# EAGLE design BEP3_Test_Interface (EAGLE 6.5.0)
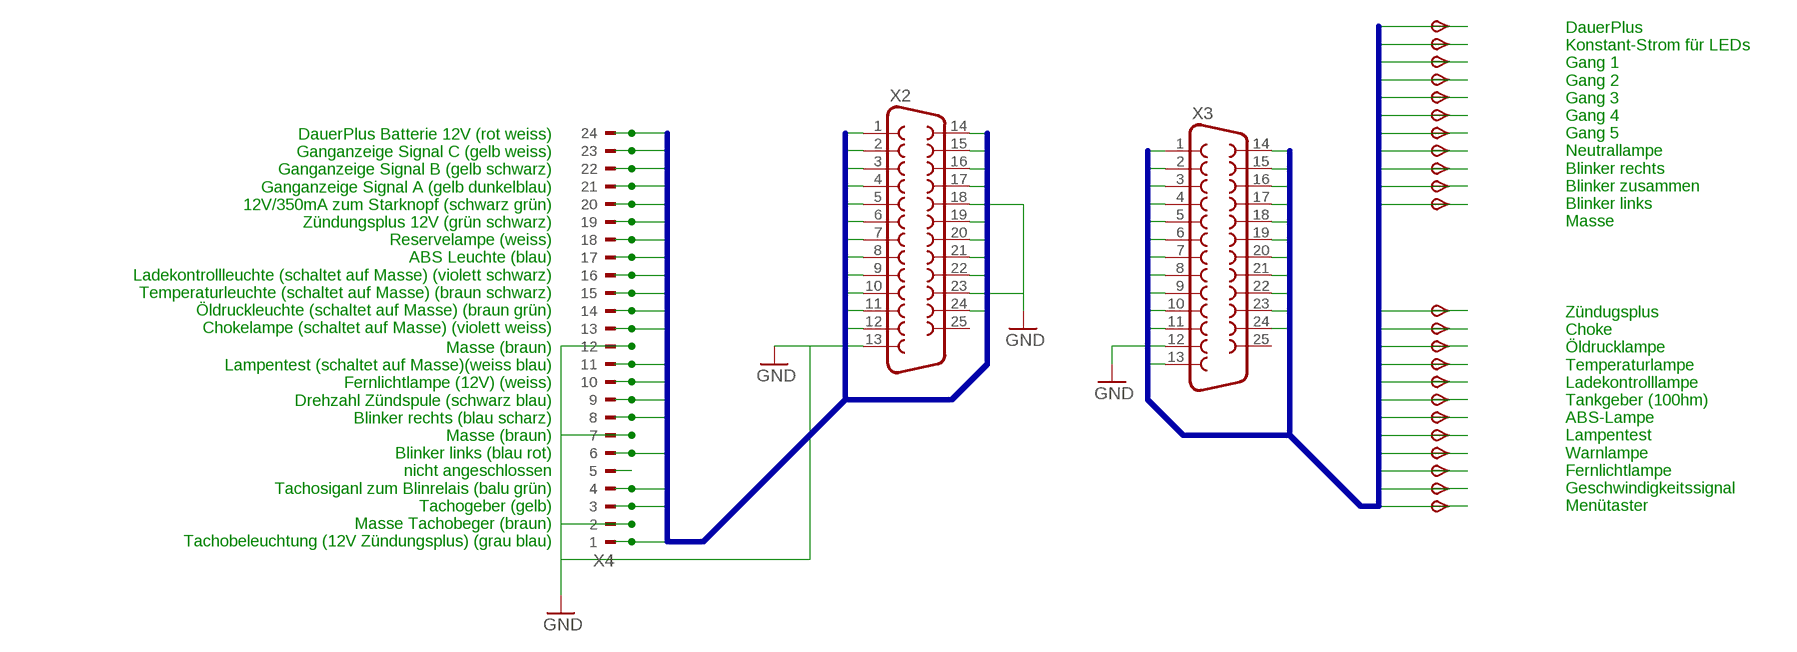
[diagram p0: schematic, sheet 1]

## Parts
TP1  TPSFEDERPIN  [1,36ID]
TP2  TPSFEDERPIN  [1,36ID]
TP3  TPSFEDERPIN  [1,36ID]
TP4  TPSFEDERPIN  [1,36ID]
TP5  TPSFEDERPIN  [1,36ID]
TP6  TPSFEDERPIN  [1,36ID]
TP7  TPSFEDERPIN  [1,36ID]
TP8  TPSFEDERPIN  [1,36ID]
TP9  TPSFEDERPIN  [1,36ID]
TP10  TPSFEDERPIN  [1,36ID]
TP11  TPSFEDERPIN  [1,36ID]
TP12  TPSFEDERPIN  [1,36ID]
TP13  TPSFEDERPIN  [1,36ID]
TP16  TPSFEDERPIN  [1,36ID]
TP17  TPSFEDERPIN  [1,36ID]
TP18  TPSFEDERPIN  [1,36ID]
TP19  TPSFEDERPIN  [1,36ID]
TP21  TPSFEDERPIN  [1,36ID]
TP22  TPSFEDERPIN  [1,36ID]
TP23  TPSFEDERPIN  [1,36ID]
TP24  TPSFEDERPIN  [1,36ID]
TP25  TPSFEDERPIN  [1,36ID]
TP26  TPSFEDERPIN  [1,36ID]
X2  F25H  [F25H]
X3  F25H  [F25H]
X4  CON_BMWTESTPINS  [24-TESTPIN_1,36ID]

## Nets
BMW1: X2.1 X4.P24
BMW2: X2.2 X4.P23
BMW3: X2.3 X4.P22
BMW4: X2.4 X4.P21
BMW5: X2.5 X4.P20
BMW6: X2.6 X4.P19
BMW7: X2.7 X4.P18
BMW8: X2.8 X4.P17
BMW9: X2.9 X4.P16
BMW10: X2.10 X4.P15
BMW11: X2.11 X4.P14
BMW12: X2.12 X4.P13
BMW14: X2.14 X4.P11
BMW15: X2.15 X4.P10
BMW16: X2.16 X4.P9
BMW17: X2.17 X4.P8
BMW19: X2.19 X4.P6
BMW20: X2.20
BMW21: X2.21 X4.P4
BMW22: X2.22 X4.P3
BMW24: X2.24 X4.P1
GND: X2.13 X2.18 X2.23 X3.12 X4.P2 X4.P7 X4.P12
N$1: X4.P5
WAGO1: TP1.P$1(PP) X3.1
WAGO2: TP2.P$1(PP) X3.2
WAGO3: TP3.P$1(PP) X3.3
WAGO4: TP4.P$1(PP) X3.4
WAGO5: TP5.P$1(PP) X3.5
WAGO6: TP6.P$1(PP) X3.6
WAGO7: TP7.P$1(PP) X3.7
WAGO8: TP8.P$1(PP) X3.8
WAGO9: TP9.P$1(PP) X3.9
WAGO10: TP10.P$1(PP) X3.10
WAGO11: TP11.P$1(PP) X3.11
WAGO13: TP12.P$1(PP) X3.13
WAGO14: TP16.P$1(PP) X3.14
WAGO15: TP17.P$1(PP) X3.15
WAGO16: TP18.P$1(PP) X3.16
WAGO17: TP19.P$1(PP) X3.17
WAGO18: TP21.P$1(PP) X3.18
WAGO19: TP22.P$1(PP) X3.19
WAGO20: TP23.P$1(PP) X3.20
WAGO21: TP24.P$1(PP) X3.21
WAGO22: TP25.P$1(PP) X3.22
WAGO23: TP26.P$1(PP) X3.23
WAGO24: TP13.P$1(PP) X3.24
Unconnected: X2.25 X3.25

## Buses
BMW[1..24]
WAGO[1..24]

## Notes on the sheet
- DauerPlus
  Konstant-Strom für LEDs
  Gang 1
  Gang 2
  Gang 3
  Gang 4
  Gang 5
  Neutrallampe
  Blinker rechts
  Blinker zusammen
  Blinker links
  Masse
- DauerPlus Batterie 12V (rot weiss)
  Ganganzeige Signal C (gelb weiss)
  Ganganzeige Signal B (gelb schwarz)
  Ganganzeige Signal A (gelb dunkelblau)
  12V/350mA zum Starknopf (schwarz grün)
  Zündungsplus 12V (grün schwarz)
  Reservelampe (weiss)
  ABS Leuchte (blau)
  Ladekontrollleuchte (schaltet auf Masse) (violett schwarz)
  Temperaturleuchte (schaltet auf Masse) (braun schwarz)
  Öldruckleuchte (schaltet auf Masse) (braun grün)
  Chokelampe (schaltet auf Masse) (violett weiss)
- Zündugsplus
  Choke
  Öldrucklampe
  Temperaturlampe
  Ladekontrolllampe
  Tankgeber (100hm)
  ABS-Lampe
  Lampentest
  Warnlampe
  Fernlichtlampe
  Geschwindigkeitssignal
  Menütaster
- Masse (braun)
  Lampentest (schaltet auf Masse)(weiss blau)
  Fernlichtlampe (12V) (weiss)
  Drehzahl Zündspule (schwarz blau)
  Blinker rechts (blau scharz)
  Masse (braun)
  Blinker links (blau rot)
  nicht angeschlossen
  Tachosiganl zum Blinrelais (balu grün)
  Tachogeber (gelb)
  Masse Tachobeger (braun)
  Tachobeleuchtung (12V Zündungsplus) (grau blau)

## Library data of the parts
TP1-TP13 TP16-TP19 TP21-TP26 = testpin_BMW:TPS: TEST PIN
X2 X3 = con-subd:F25: SUB-D; OC_FARNELL: unknown; OC_NEWARK: unknown
X4 = con_BMW:CON_BMW: BMW CONNECTOR

## Board
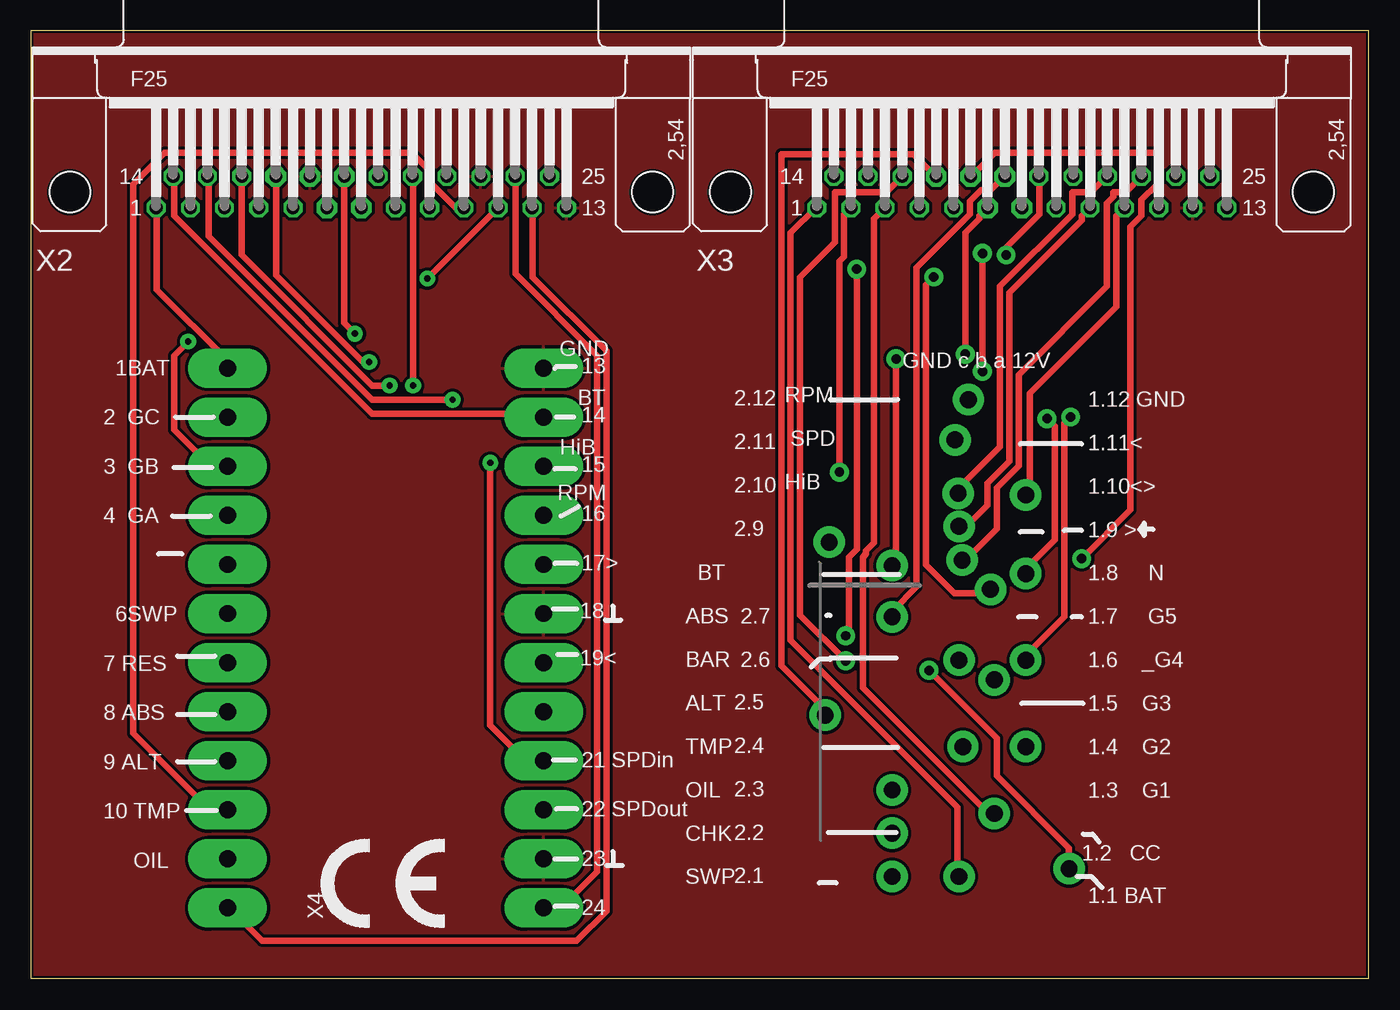
[diagram p1: board, top side]
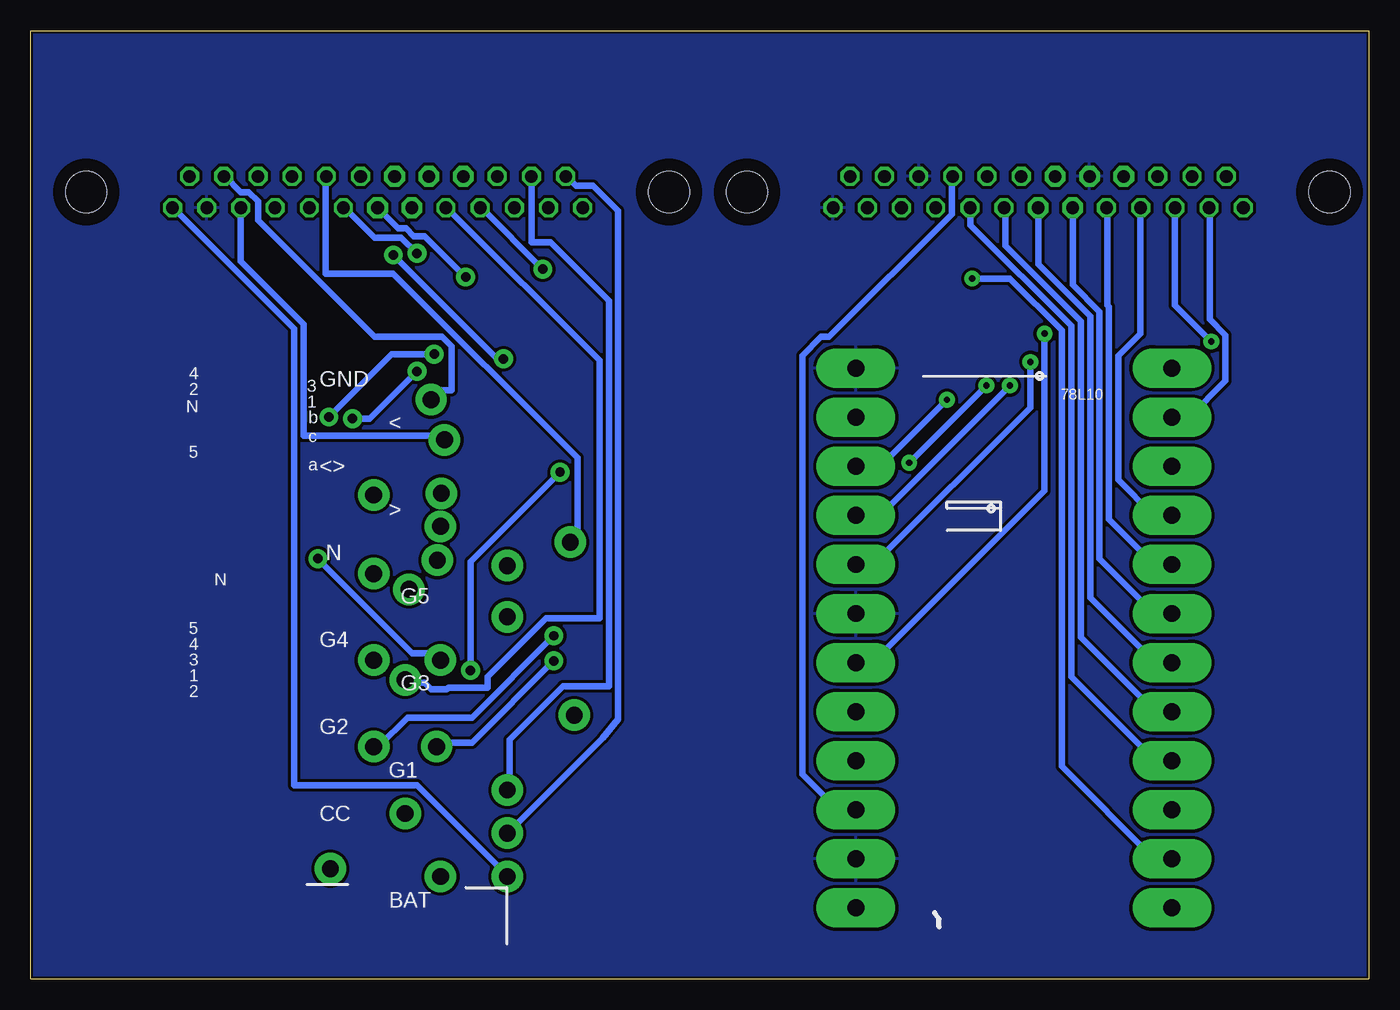
[diagram p2: board, bottom side, seen from below]

Size 108 x 76.5 mm. Coordinates in mm from the lower left corner, seen from the top.
Outline: 108,76.5 0,76.5 0,0 108,0 108,76.5
Copper layers (1*16): Top 0.035mm / dielectric 1.5mm / Bottom 0.035mm
Design rules "default *": minimum track width 20mil, minimum drill 20mil, track to track 10mil, track to pad 10mil, pad to pad 10mil, via to via 10mil, smd to smd 8mil, copper to edge 8mil, drill to drill 8mil, minimum pad ring 10mil, minimum via ring 15mil, stop-mask expansion 4mil, vias tented up to drill 0mil, thermal gap 10mil

### Footprints (pad centres in the part's own frame; a part is rotated, then mirrored left to right if it is on the bottom)
1,36ID = drill 1.36 pad 2.54: P$1 0,0
F25H = drill 1.016 octagon: 1 -16.561,-1.27; 2 -13.792,-1.27; 3 -11.049,-1.27; 4 -8.28,-1.27; 5 -5.512,-1.27; 8 2.769,-1.27; 9 5.512,-1.27; 10 8.28,-1.27; 11 11.049,-1.27; 12 13.792,-1.27; 13 16.561,-1.27; 14 -15.189,1.27; 15 -12.421,1.27; 16 -9.652,1.27; 20 1.372,1.27; 21 4.14,1.27; 22 6.909,1.27; 23 9.652,1.27; 24 12.421,1.27; 25 15.189,1.27 | drill 1.016 pad 1.67 octagon: 6 -2.769,-1.27; 7 0,-1.27; 17 -6.909,1.27; 18 -4.14,1.27; 19 -1.372,1.27 | hole 3.302: -23.52,0; 23.52,0
24-TESTPIN_1,36ID = drill 1.36 pad 3.2 long: P1 -21.78,-12.76; P2 -17.82,-12.76; P3 -13.86,-12.76; P4 -9.9,-12.76; P5 -5.94,-12.76; P6 -1.98,-12.76; P7 1.98,-12.76; P8 5.94,-12.76; P9 9.9,-12.76; P10 13.86,-12.76; P11 17.82,-12.76; P12 21.78,-12.76; P13 -21.78,12.76; P14 -17.82,12.76; P15 -13.86,12.76; P16 -9.9,12.76; P17 -5.94,12.76; P18 -1.98,12.76; P19 1.98,12.76; P20 5.94,12.76; P21 9.9,12.76; P22 13.86,12.76; P23 17.82,12.76; P24 21.78,12.76

### Placement (x,y rotation side)
TP1  74.93,8.26 0 bottom
TP2  83.82,8.89 0 bottom
TP3  77.79,13.34 0 bottom
TP4  80.33,18.73 0 bottom
TP5  77.79,24.13 0 bottom
TP6  80.33,25.72 0 bottom
TP7  77.47,31.43 0 bottom
TP8  80.33,32.7 0 bottom
TP9  74.93,36.51 0 bottom
TP10  80.33,39.05 0 bottom
TP11  74.61,43.5 0 bottom
TP12  69.53,8.26 0 bottom
TP13  75.69,46.74 0 bottom
TP16  69.53,11.75 0 bottom
TP17  69.53,15.24 0 bottom
TP18  75.25,18.73 0 bottom
TP19  64.14,21.27 0 bottom
TP21  74.93,25.72 0 bottom
TP22  69.53,29.21 0 bottom
TP23  69.53,33.34 0 bottom
TP24  64.45,35.24 0 bottom
TP25  74.87,39.18 0 bottom
TP26  75.18,33.78 0 bottom
U$1  [CE_10.00]  23.37,4.06 0 top
X2  26.67,63.5 0 top
X3  80.01,63.5 0 top
X4  28.64,27.5 90 top

### Tracks (layer width: path | path; a pad name or v marks a point on that pad's centre or on a via)
BMW1
  Top 0.508: X4.P24 15.88,49.91 10.16,55.63 10.16,62.23 X2.1
BMW2
  Bottom 0.508: X2.2 12.83,62.23 12.83,53.21 11.56,51.94 11.56,48.26 14.48,45.34 15.88,45.34 X4.P23
BMW3  (via drill 0.51)
  Top 0.508: v12.7,51.44 11.56,50.29 11.56,44.32 14.48,41.4 15.88,41.4 X4.P22
  Bottom 0.508: X2.3 15.62,54.36 v12.7,51.44
BMW4
  Bottom 0.508: X2.4 18.41,62.23 18.41,52.07 20.19,50.29 20.19,40.26 17.4,37.47 15.88,37.47 X4.P21
BMW5
  Bottom 0.508: X2.5 21.08,62.23 21.08,54.36 20.95,54.23 20.95,37.08 17.4,33.53 15.88,33.53 X4.P20
BMW6
  Bottom 0.508: X2.6 23.88,62.23 23.88,56.01 21.72,53.85 21.72,33.91 17.4,29.59 15.88,29.59 X4.P19
BMW7
  Bottom 0.508: X2.7 26.67,57.66 22.48,53.47 22.48,30.73 17.27,25.53 X4.P18
BMW8
  Bottom 0.508: X2.8 29.34,62.23 29.34,59.18 23.24,53.09 23.24,27.56 17.27,21.59 15.88,21.59 X4.P17
BMW9
  Bottom 0.508: X2.9 32.13,62.23 32.13,60.83 24,52.7 24,24.38 17.27,17.65 15.88,17.65 X4.P16
BMW10
  Top 0.508: X2.10 34.29,62.23 32.13,64.39 32.13,65.28 30.73,66.67 10.79,66.67 8.26,64.14 8.26,19.81 14.35,13.72 15.88,13.72 X4.P15
BMW11  (via drill 0.51)
  Top 0.508: v32,56.52 X2.11
  Bottom 0.508: v32,56.52 28.96,56.52 24.77,52.32 24.77,17.14 17.4,9.78 15.88,9.78 X4.P14
BMW12
  Top 0.508: X2.12 40.51,62.23 40.51,56.64 46.48,50.67 46.48,5.46 44.07,3.05 18.67,3.05 15.88,5.84 X4.P13
BMW14
  Top 0.508: X2.14 11.56,64.77 11.56,61.59 27.56,45.59 41.02,45.59 41.27,45.34 X4.P11
BMW15  (via drill 0.51)
  Top 0.508: v34.04,46.74 27.56,46.74 14.35,59.94 14.35,64.77 X2.15
  Bottom 0.508: v34.04,46.74 39.37,41.4 41.27,41.4 X4.P10
BMW16  (via drill 0.51)
  Top 0.508: X2.16 17.02,58.42 27.56,47.88 v28.96,47.88
  Bottom 0.508: v28.96,47.88 39.37,37.47 41.27,37.47 X4.P9
BMW17  (via drill 0.51)
  Top 0.508: v27.3,49.78 26.8,49.78 19.81,56.77 19.81,64.77 X2.17
  Bottom 0.508: v27.3,49.78 27.3,46.1 39.88,33.53 41.27,33.53 X4.P8
BMW19  (via drill 0.51)
  Top 0.508: v26.16,52.07 25.27,52.96 25.27,64.77 X2.19
  Bottom 0.508: v26.16,52.07 26.16,39.37 40.01,25.53 41.27,25.53 X4.P6
BMW21  (via drill 0.51)
  Top 0.508: v30.86,47.88 30.86,64.77 X2.21 | v37.08,41.66 37.08,20.45 39.88,17.65 41.27,17.65 X4.P4
  Bottom 0.508: v37.08,41.66 v30.86,47.88
BMW22
  Bottom 0.508: X2.22 33.66,64.77 33.66,61.72 43.56,51.82 44.2,51.82 45.72,50.29 45.72,16.51 42.93,13.72 41.4,13.72 X4.P3
BMW24
  Top 0.508: X2.24 39.12,64.77 39.12,56.9 45.72,50.29 45.72,8.64 42.93,5.84 41.4,5.84 X4.P1
GND
  pour Bottom (rank 3): 0.08,76.58 107.89,76.58 107.89,-0.49 84.95,-0.22 -0.05,-0.25
  pour Top: -0.43,76.58 107.89,76.58 108.27,0.03 -0.05,-0.13
WAGO1
  Top 0.508: TP1.P$1 74.8,8.38 74.8,13.84 61.34,27.3 61.34,60.2 63.37,62.23 X3.1
WAGO2  (via drill 0.76)
  Top 0.508: v65.28,40.89 65.28,57.91 65.66,58.29 65.66,61.72 66.17,62.23 X3.2 | v72.52,24.89 77.98,19.43 77.98,16.38 83.82,10.54 TP2.P$1
  Bottom 0.508: v65.28,40.89 72.52,33.66 v72.52,24.89
WAGO3
  Top 0.508: X3.3 68.07,61.34 68.07,35.18 67.44,34.54 67.44,34.29 67.18,34.04 67.18,23.5 77.34,13.34 TP3.P$1
WAGO4  (via drill 0.76)
  Top 0.508: v66.67,57.28 66.67,34.67 66.04,34.04 66.04,27.94 v65.79,27.69
  Bottom 0.508: v66.67,57.28 71.63,62.23 X3.4 | v65.79,27.69 72.39,21.08 77.6,21.08 79.88,18.8 80.26,18.8 TP4.P$1
WAGO5
  Bottom 0.508: X3.5 74.42,62.23 62.1,49.91 62.1,29.08 66.42,29.08 71.12,24.38 71.12,23.5 74.3,23.5 74.42,23.37 75.69,23.37 76.2,23.88 77.47,23.88 77.72,24.13 TP5.P$1
WAGO6  (via drill 0.76)
  Top 0.508: v75.44,50.42 75.44,60.2 76.58,61.34 76.58,61.59 77.22,62.23 X3.6 | v83.95,45.34 83.44,44.83 83.44,29.21 80.39,26.16 80.39,25.78 TP6.P$1
  Bottom 0.508: v75.44,50.42 78.87,50.42 v83.95,45.34
WAGO7  (via drill 0.76)
  Top 0.508: v72.9,56.64 72.26,56.01 72.26,33.4 74.55,31.11 77.47,31.11 TP7.P$1
  Bottom 0.508: X3.7 78.36,60.58 77.72,60.58 77.09,59.94 76.2,59.94 v72.9,56.64
WAGO8  (via drill 0.76)
  Top 0.508: v76.83,49.02 v76.83,58.55 | v82.04,45.21 82.68,44.58 82.68,35.43 80.39,33.15 80.39,32.77 TP8.P$1
  Bottom 0.508: v76.83,58.55 78.11,59.82 80.26,59.82 82.68,62.23 X3.8 | v76.83,49.02 80.64,45.21 v82.04,45.21
WAGO9
  Top 0.508: X3.9 85.47,62.23 84.84,61.59 84.84,61.21 78.99,55.37 78.99,41.78 77.22,40.01 77.22,38.23 75.56,36.58 74.93,36.58 TP9.P$1
WAGO10
  Top 0.508: TP10.P$1 80.64,39.37 80.64,47.24 87.63,54.23 87.63,61.59 88.27,62.23 X3.10
WAGO11
  Bottom 0.508: X3.11 91.06,57.91 85.98,52.83 85.98,43.81 74.93,43.81 TP11.P$1
WAGO13
  Bottom 0.508: X3.13 96.52,62.23 86.74,52.45 86.74,15.62 76.83,15.62 69.47,8.26 TP12.P$1
WAGO14
  Bottom 0.508: X3.14 64.77,64.77 64.01,64.01 62.61,64.01 60.58,61.98 60.58,20.95 61.85,19.43 TP16.P$1
WAGO15
  Bottom 0.508: TP17.P$1 69.34,15.24 69.34,19.3 65.02,23.62 61.34,23.62 61.34,54.74 66.04,59.44 67.56,59.44 67.56,64.77 X3.15
WAGO16  (via drill 0.76)
  Top 0.508: X3.16 69.09,63.5 64.9,63.5 64.9,59.44 62.1,56.64 62.1,29.34 v65.79,25.65
  Bottom 0.508: v65.79,25.65 72.39,19.05 74.93,19.05 TP18.P$1
WAGO17
  Top 0.508: TP19.P$1 64.14,21.72 60.58,25.27 60.58,66.55 71.25,66.55 73.03,64.77 X3.17
WAGO18  (via drill 0.76)
  Top 0.508: v84.84,33.91 88.77,37.85 88.77,60.71 89.66,61.59 89.66,62.87 90.93,64.14 90.93,66.67 77.85,66.67 75.95,64.77 X3.18
  Bottom 0.508: v84.84,33.91 77.22,26.29 75.95,26.29 75.44,25.78 74.93,25.78 TP21.P$1
WAGO19
  Top 0.508: X3.19 78.61,64.77 77.47,63.63 76.71,63.63 75.82,62.74 75.82,61.72 71.5,57.4 71.5,31.62 69.6,29.72 69.6,29.21 TP22.P$1
WAGO20  (via drill 0.76)
  Top 0.508: v78.74,58.42 78.74,59.05 81.41,61.72 81.41,64.77 X3.20 | v69.85,50.04 69.85,33.66 TP23.P$1
  Bottom 0.508: v78.74,58.42 70.36,50.04 v69.85,50.04
WAGO21
  Bottom 0.508: X3.21 84.2,64.77 84.2,56.9 78.74,56.9 63.88,42.04 63.88,35.31 64.39,35.31 TP24.P$1
WAGO22
  Top 0.508: X3.22 86.87,64.77 85.6,63.5 84.07,63.5 84.07,61.72 78.23,55.88 78.23,42.93 74.93,39.62 74.93,39.24 TP25.P$1
WAGO23
  Top 0.508: X3.23 88.39,63.5 87.38,63.5 87.38,63.12 86.87,62.61 86.87,55.88 79.76,48.77 79.76,41.4 77.98,39.62 77.98,36.32 75.44,33.78 TP26.P$1
WAGO24
  Bottom 0.508: TP13.P$1 75.56,46.74 74.8,47.5 74.04,47.5 74.04,51.05 74.8,51.82 80.26,51.82 89.66,61.21 89.66,62.74 90.42,63.5 91.06,63.5 92.33,64.77 X3.24

### Text on the board
bPlace: 4 | 3 | 2 | 1 | b | c | 5 | a | 5 | 4 | 3 | 1 | 2
tNames: GND c b a 12V | GND / BT / HiB | RPM | RPM / SPD / HiB | 18 | 19< | 2.7 / 2.6 | 1.12 GND / 1.11< / 1.10<> / 1.9 > / 1.8 N / 1.7 G5 / 1.6 _G4 / 1.5 G3 / 1.4 G2 / 1.3 G1 | 1.2 CC | BT / ABS / BAR / ALT / TMP / OIL / CHK / SWP | 1.1 BAT | 1BAT / 2 GC / 3 GB / 4 GA / / 6SWP / 7 RES / 8 ABS / 9 ALT / 10 TMP / OIL | 2.12 / 2.11 / 2.10 / 2.9 / / / / 2.5 / 2.4 / 2.3 / 2.2 / 2.1 | 13 / 14 / 15 / 16 / 17> / / / / 21 SPDin / 22 SPDout / 23 / 24
bNames: 78L10 | N | N | < / / > / / G5 / / G3 / / G1 / / / BAT | GND / / <> / / N / / G4 / / G2 / / CC
tValues: set jumper for / motoscope tiny / support
bValues: BA | BA | 6,8 | 2.4V/1.1V | 4 | 13 GND / 14 BT / 15 HiB / 16 RPM / 17 > / 18 GND / 19 < / / 21 SPD in / 22 SPD o / 23 GND | SPD / / WRN / / ABS / / ALT / / OIL / / SWP | RPM / / HiB / / BT / / BAR / / TMP / / CHK | BA | BA | 1 BAT / 2 GC / 3 GB / 4 GA / 5 START / 6 SWP / 7R ES / 8A BS / 9 / 10 TMP / 11 OIL / 12CH K